# EasyEDA Pro project PCB_ESP32-music-int-document.epro

# Board PCB_PCB_ESP32-sd-int
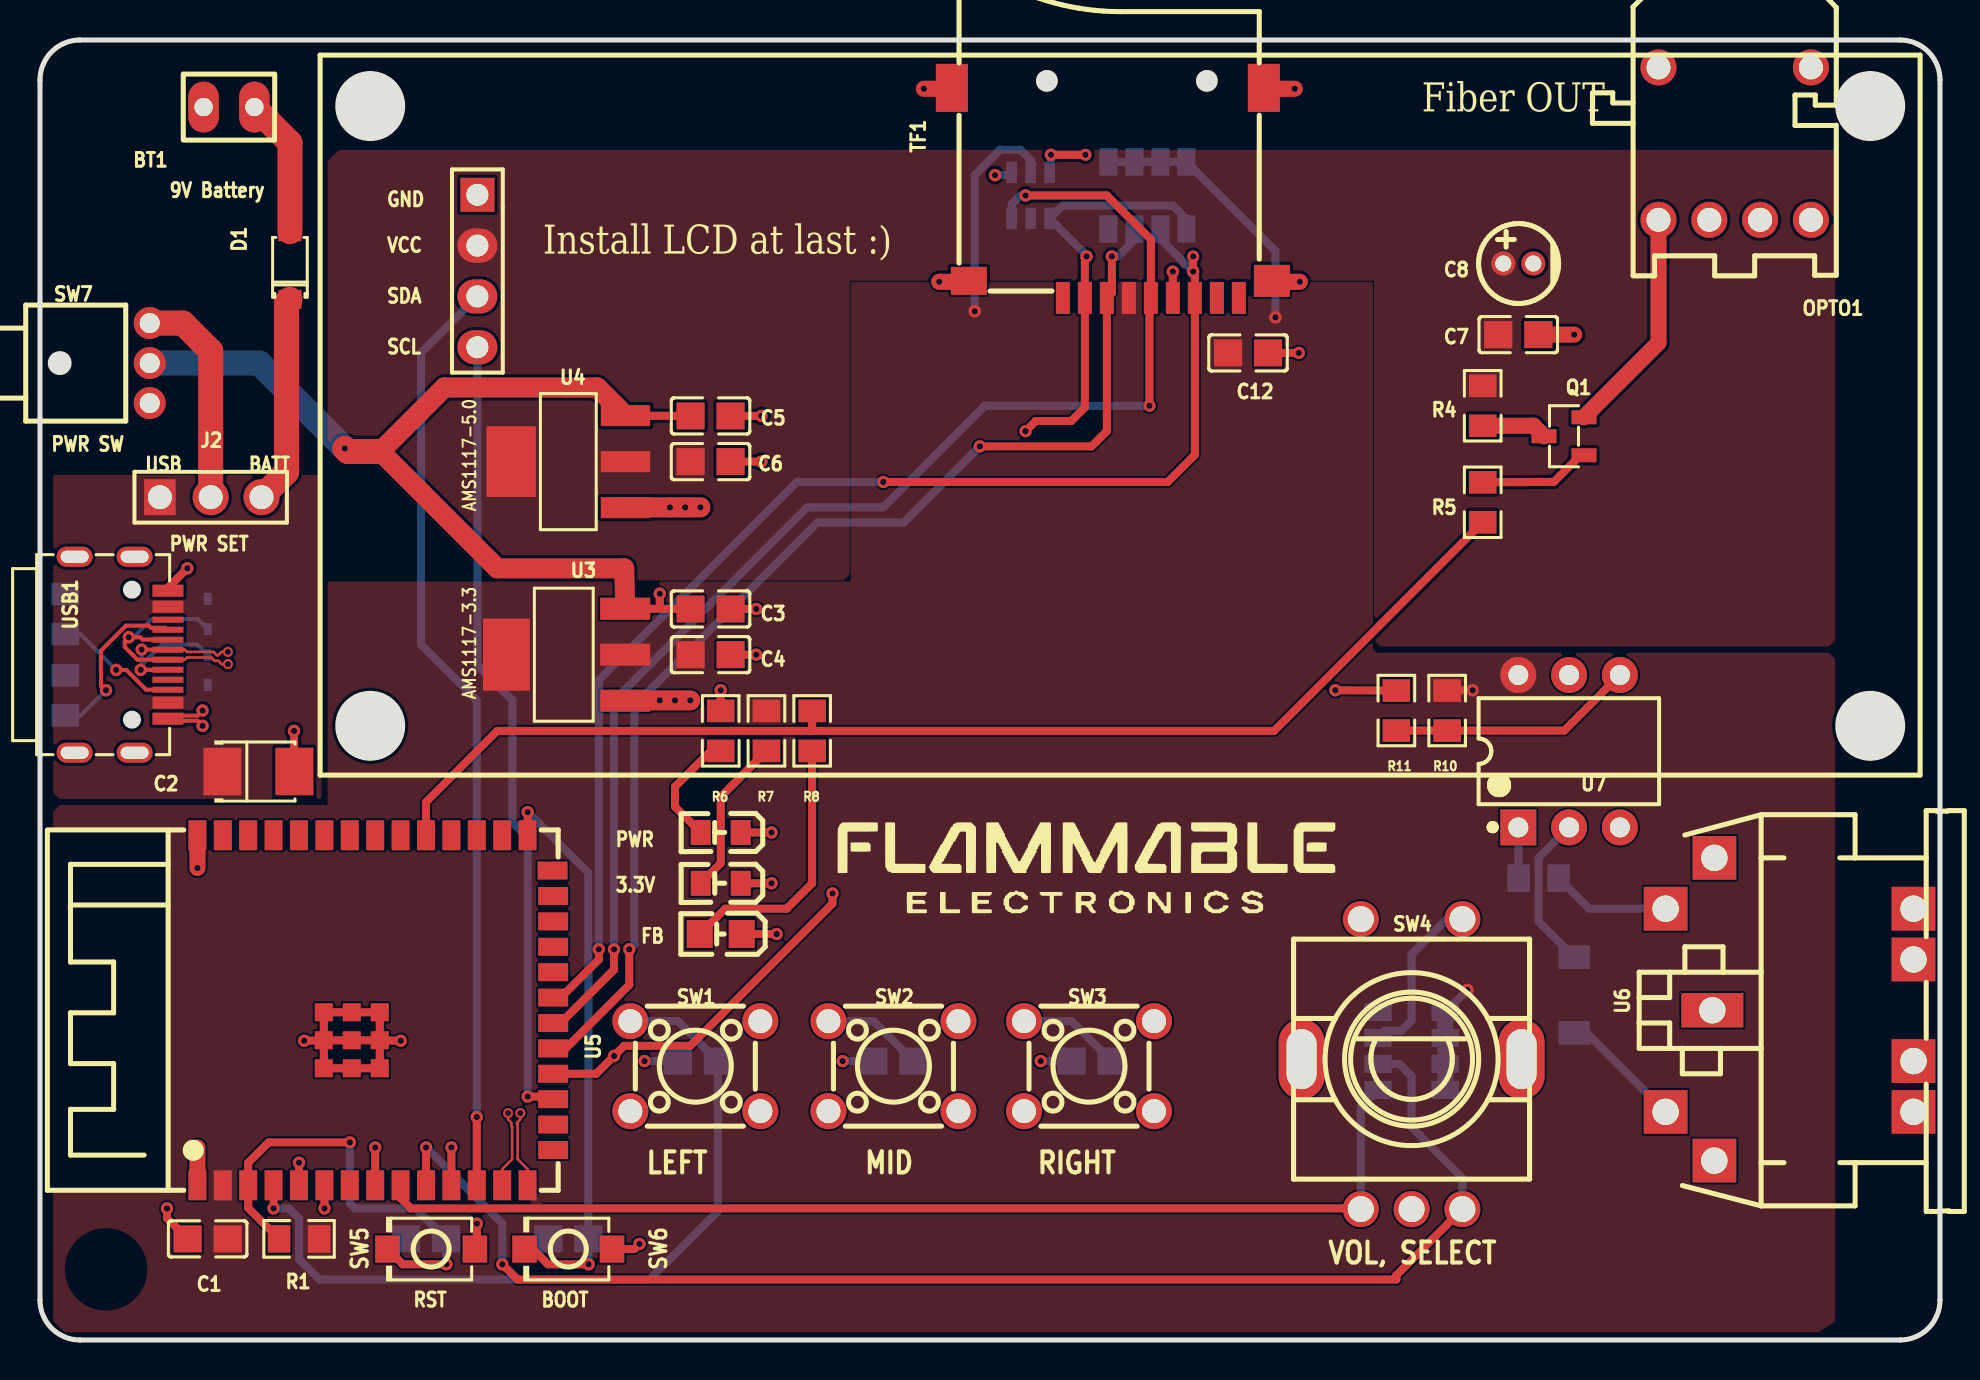
[diagram p0: board, top side]
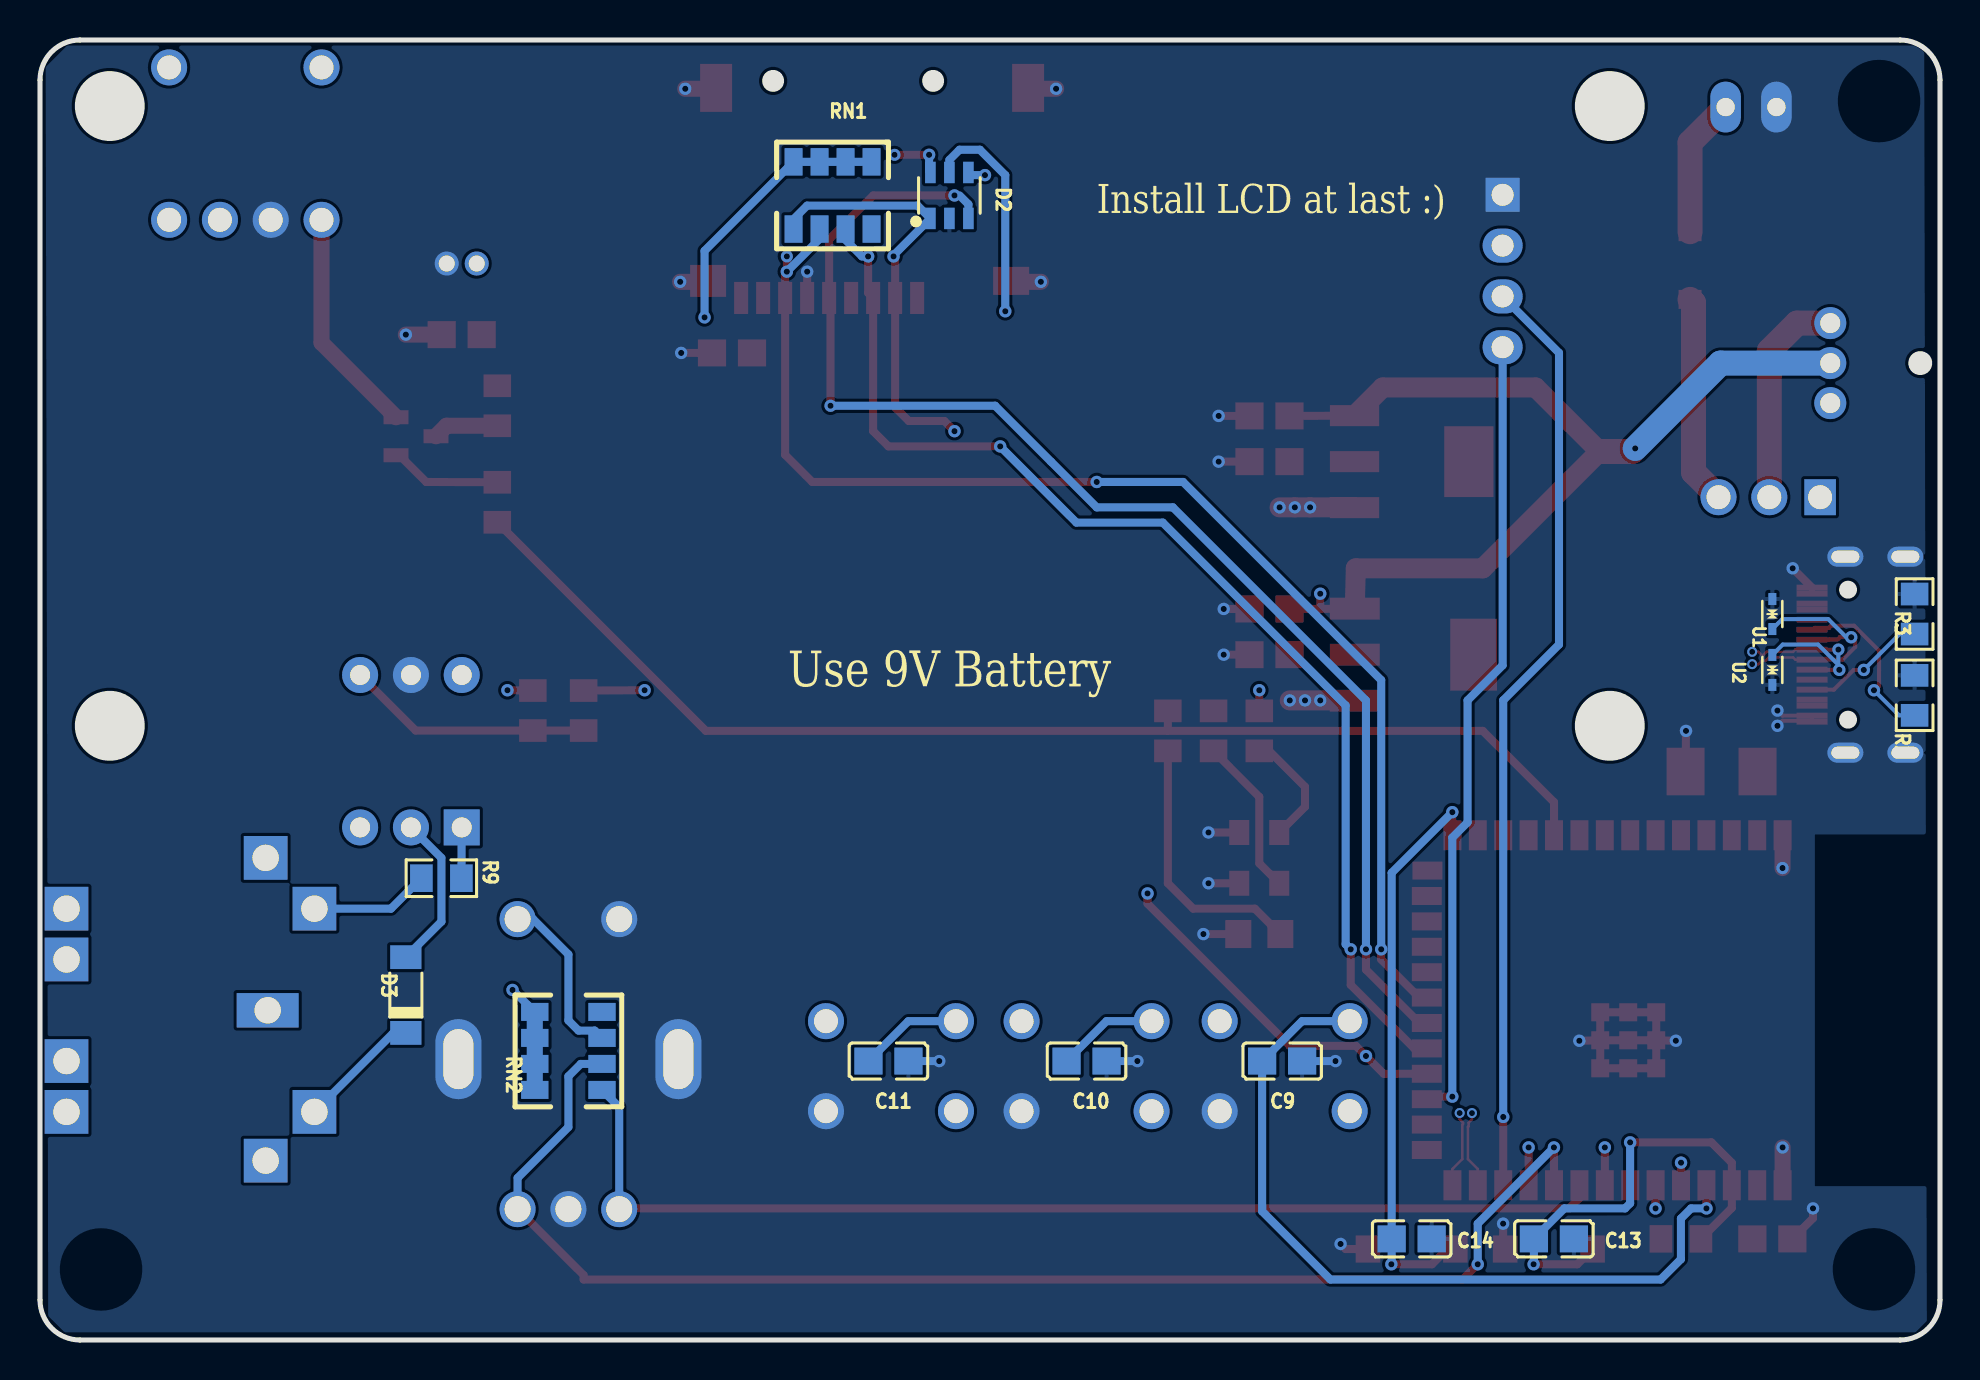
[diagram p1: board, bottom side, seen from below]

Outline 95 x 65 mm; copper layers: Top Layer, Inner1, Inner2, Bottom Layer. Coordinates in mm from the lower left corner of the outline.
Outline path: 0,63 arc(0.59,64.41) 2,65 93,65 arc(94.41,64.41) 95,63 95,2 arc(94.41,0.59) 93,0 2,0 arc(0.59,0.59) 0,2 0,63
Stack: Top Layer 0.035mm / Dielectric1 0.48mm PP er 4.5 / Inner1 0.035mm / Dielectric2 0.48mm FR4 er 4.5 / Inner2 0.035mm / Dielectric3 0.48mm PP er 4.5 / Bottom Layer 0.035mm

## Design rules (mm)
net USB_P: DP1
net USB_N: DP1
template: User Custom Config
spacing Default (default): track to track 0.1, other pairs 0 to 0.1
track width Default (default): min 0.254, default 0.254, max 25.4
differential pair differentialPair (default): width min 0.127, default 0.127, max 0.127; gap min 0.152, default 0.152
via Default (default): diameter min 0.5, default 0.6, max 100.025; hole min 0.3, default 0.305, max 59.995
pour e112 uses gge9877
pour e150 uses gge9877(1)
pour e344 uses gge17428
pour e346 uses gge21029
pour e340 uses copperRegion1

## Placement (name value [footprint] x y rotation side)
BT1  9V battery  [BAT-TH_2P-9VBATTERY]  9.45 61.65 180 top
C1  100nF  [C0805]  8.38 5.06 0 top
C2  10uF  [CAP-SMD_L3.2-W2.8-FD]  10.92 28.42 0 top
C3  10uF  [C0805]  33.53 36.55 180 top
C4  10uF  [C0805]  33.53 34.27 180 top
C5  10uF  [C0805]  33.53 46.2 180 top
C6  10uF  [C0805]  33.53 43.92 180 top
C7  100nF  [C0805]  73.91 50.27 0 top
C8  10uF  [CAP-TH_BD4.0-P1.50-D0.8-FD]  73.91 53.82 0 top
C9  100nF  [C0805]  32.89 13.95 0 bottom
C10  100nF  [C0805]  42.67 13.95 0 bottom
C11  100nF  [C0805]  52.58 13.95 0 bottom
C12  100nF  [C0805]  60.4 49.35 0 top
C13  100nF  [C0805]  19.3 5.06 0 bottom
C14  100nF  [C0805]  26.42 5.06 0 bottom
D1  DSS34  [SOD-123_L2.8-W1.8-LS3.7-RD]  12.5 53.72 90 top
D2  BV-SRV05-4  [SOT-23-6_L2.9-W1.6-P0.95-LS2.8-BL]  49.53 57.23 180 bottom
D3  1N4148-1206D  [LL-34_L3.5-W1.5-R-RD]  76.71 17.25 90 bottom
J2  Power settings  [HDR-TH_3P-P2.54-V-M-1]  8.53 42.14 0 top
LCD1  -  [I2CLCD16X2]  16.51 30.71 0 top
LED1  0805 SF-RED  [LED0805-RD_RED]  34.04 22.84 180 top
LED2  SF-RED  [LED0805-RD_RED]  34.04 25.38 180 top
LED3  YLED0805G  [LED0805-FD-GREEN]  34.03 20.3 0 top
OPTO1  HFBR-1521Z  [CONN-TH_HFBR-1521Z]  84.73 59.82 180 top
Q1  SS8050S  [SOT-23-3_L2.9-W1.3-P0.95-LS2.4-BR]  76.2 45.19 0 top
R1  10kΩ  [R0805]  12.95 5.06 0 top
R2  5.1kΩ  [R0805]  1.27 32.23 270 bottom
R3  5.1kΩ  [R0805]  1.27 36.3 270 bottom
R4  33Ω  [R0805]  72.14 46.71 90 top
R5  470Ω  [R0805]  72.14 41.89 90 top
R6  10kΩ  [R0805]  34.04 30.46 90 top
R7  1.3kΩ  [R0805]  36.32 30.46 90 top
R8  2.2kΩ  [R0805]  38.61 30.46 270 top
R9  220Ω  [R0805]  74.93 23.09 180 bottom
R10  180Ω  [R0805]  70.36 31.47 270 top
R11  47Ω  [R0805]  67.82 31.47 90 top
RN1  10kΩ  [RES-ARRAY-SMD_1206-8P-L5.1-W3.1-BL]  55.37 57.23 180 bottom
RN2  10kΩ  [RES-ARRAY-SMD_1206-8P-L5.1-W3.1-BL]  68.58 14.45 90 bottom
SW1  TC-6610-18.0  [SW-TH_4P-L6.0-W6.0-P4.50-LS6.5]  32.77 13.69 0 top
SW2  TC-6610-18.0  [SW-TH_4P-L6.0-W6.0-P4.50-LS6.5]  42.67 13.69 0 top
SW3  TC-6610-18.0  [SW-TH_4P-L6.0-W6.0-P4.50-LS6.5]  52.45 13.69 0 top
SW4  EC11E18244A5  [SW-TH_EC11E18244A5]  68.58 13.79 0 top
SW5  TS-1088-AR02016  [SW-SMD_L3.9-W3.0-P4.45]  19.56 4.55 180 top
SW6  TS-1088-AR02016  [SW-SMD_L3.9-W3.0-P4.45]  26.42 4.55 180 top
SW7  5.8 WSGT-3P CC  [SW-TH_3P-L5.8_WSGT-3P-CC]  5.49 48.85 270 top
TF1  SD  [TF-SMD_TF-15-15]  53.59 57.35 90 top
U1  LESD5D5.0CT1G_C5246195  [SOD-523_L1.2-W0.8-LS1.6-BI]  8.38 36.3 270 bottom
U2  LESD5D5.0CT1G_C5246195  [SOD-523_L1.2-W0.8-LS1.6-BI]  8.38 33.5 90 bottom
U3  AMS1117-3.3  [SOT-223-3_L6.5-W3.4-P2.30-LS7.0-BR]  26.29 34.27 0 top
U4  AMS1117-5.0  [SOT-223_L6.5-W3.5-P2.30-LS7.0-BR]  26.42 43.92 0 top
U5  ESP32-S3-WROOM-1(N8R8)  [WIRELM-SMD_ESP32-S3-WROOM-1]  16.76 16.49 90 top
U6  MIDIJACK  [CP-2350]  87.48 16.54 90 top
U7  H11L1  [DIP-6_L8.5-W6.4-P2.54-LS7.6-BL]  76.45 29.44 0 top
USB1  MUP-U20409-2  [USB-C-SMD_MUP-U20409-2]  4.06 34.27 270 top

## Footprints (pads in the part's own frame, mm; a bottom-side part is the same pattern mirrored in y, then rotated)
BAT-TH_2P-9VBATTERY
  oval 1.524x2.54 hole 0.914: 1(-1.27,0) 2(1.27,0)
C0805
  rect 1.41x1.35 smd: 1(-1,0) 2(1,0)
CAP-SMD_L3.2-W2.8-FD
  rect 1.9x2.376 smd: 1(-1.798,0) 2(1.798,0)
CAP-TH_BD4.0-P1.50-D0.8-FD
  round 1.2 hole 0.8: 1(-0.75,0) 2(0.75,0)
CONN-TH_HFBR-1521Z
  round 1.8 hole 1.2: 1(3.81,3.81) 2(1.27,3.81) 3(-1.27,3.81) 4(-3.81,3.81) 5(-3.81,-3.81) 8(3.81,-3.81)
CP-2350
  rect 2.184x2.184 hole 1.321: 1(7.569,3.76) 3(-7.569,3.76) 4(5.029,6.197) 5(-5.131,6.197) PE(-2.591,-6.197) PE1(-5.131,-6.197) PE2(5.029,-6.197) PE@(2.489,-6.197)
  rect 1.72x3.096 hole 1.321: 2(-0.051,3.861)
DIP-6_L8.5-W6.4-P2.54-LS7.6-BL
  rect 1.8x1.8 hole 1: 1(-2.54,-3.81)
  round 1.8 hole 1: 2(0,-3.81) 3(2.54,-3.81) 4(2.54,3.81) 5(0,3.81) 6(-2.54,3.81)
HDR-TH_3P-P2.54-V-M-1
  rect 1.575x1.8 hole 1.2: 1(-2.54,0)
  round 1.8 hole 1.2: 2(0,0) 3(2.54,0)
I2CLCD16X2
  rect 1.7x1.7 hole 1.1: 1(5.359,26.549)
  oval 2x1.7 hole 1.1: 2(5.359,24.009) 3(5.359,21.469) 4(5.359,18.929)
LED0805-FD-GREEN
  rect 1.3x1.399 smd: 1(-1.05,0) 2(1.05,0)
LED0805-RD_RED
  rect 1x1.25 smd: 1(-1,0) 2(1,0)
LL-34_L3.5-W1.5-R-RD
  rect 1.185x1.566 smd: 1(1.893,0) 2(-1.893,0)
R0805
  rect 1.133x1.377 smd: 1(-1,0) 2(1,0)
RES-ARRAY-SMD_1206-8P-L5.1-W3.1-BL
  rect 0.9x1.37 smd: 1(-1.95,-1.68) 2(-0.65,-1.68) 3(0.65,-1.68) 4(1.95,-1.68) 5(1.95,1.68) 6(0.65,1.68) 7(-0.65,1.68) 8(-1.95,1.68)
SOD-123_L2.8-W1.8-LS3.7-RD
  rect 0.95x1.15 smd: 1(-1.692,0) 2(1.692,0)
SOD-523_L1.2-W0.8-LS1.6-BI
  rect 0.6x0.4 smd: 1(-0.75,0) 2(0.75,0)
SOT-23-3_L2.9-W1.3-P0.95-LS2.4-BR
  rect 1.25x0.7 smd: 1(1,-0.95) 2(1,0.95) 3(-1,0)
SOT-23-6_L2.9-W1.6-P0.95-LS2.8-BL
  rect 0.532x1.072 smd: 1(-0.95,-1.149) 2(0,-1.149) 3(0.95,-1.149) 4(0.95,1.149) 5(0,1.149) 6(-0.95,1.149)
SOT-223-3_L6.5-W3.4-P2.30-LS7.0-BR
  rect 2.5x1.1 smd: 1(2.97,-2.3) 2(2.97,0) 3(2.97,2.3)
  rect 2.34x3.6 smd: 4(-2.97,0)
SOT-223_L6.5-W3.5-P2.30-LS7.0-BR
  rect 2.465x1.05 smd: 1(2.857,-2.3) 2(2.857,0) 3(2.857,2.3)
  rect 2.465x3.54 smd: 4(-2.857,0)
SW-SMD_L3.9-W3.0-P4.45
  rect 1.23x1.36 smd: 1(-2.185,0) 2(2.185,0)
SW-TH_3P-L5.8_WSGT-3P-CC
  round 1.6 hole 1: 1(-2,0) 2(0,0) 3(2,0)
SW-TH_4P-L6.0-W6.0-P4.50-LS6.5
  round 1.8 hole 1.2: 1(-3.25,2.25) 2(3.25,2.25) 3(-3.25,-2.25) 4(3.25,-2.25)
SW-TH_EC11E18244A5
  oval 2.3x4 hole 1.5x3: 6(5.5,0.25) 7(-5.5,0.25)
  round 1.8 hole 1.3: A(-2.54,-7.25) B(2.54,-7.25) C(0,-7.25) D(-2.54,7.25) E(2.54,7.25)
TF-SMD_TF-15-15
  rect 1.6x0.701 smd: 1(-5.252,2.45) 2(-5.252,1.35) 3(-5.252,0.25) 4(-5.252,-0.85) 5(-5.252,-1.95) 6(-5.252,-3.05) 7(-5.252,-4.15) 8(-5.252,-5.25) 9(-5.252,-6.35)
  rect 1.6x1.8 smd: 10(-4.399,-8)
  rect 2.4x1.6 smd: 11(5.252,-7.6) 12(5.252,8)
  rect 1.399x1.801 smd: 13(-4.398,7.151)
USB-C-SMD_MUP-U20409-2
  oval 1x1.8 hole 0.6x1.4: 17(4.9,0.667) 18(4.9,-2.333) 19(-4.9,-2.333) 20(-4.9,0.667)
  rect 0.3x1.55 smd: A1(-3.35,2.333) A4(-2.55,2.333) A5(-1.25,2.333) A6(-0.25,2.333) A7(0.25,2.333) A8(1.25,2.333) A9(2.55,2.333) A12(3.35,2.333) B1(3.05,2.333) B4(2.25,2.333) B5(1.75,2.333) B6(0.75,2.333) B7(-0.75,2.333) B8(-1.75,2.333) B9(-2.25,2.333) B12(-3.05,2.333)
WIRELM-SMD_ESP32-S3-WROOM-1
  rect 1.5x0.9 smd: 1(-8.75,8.895) 2(-8.75,7.625) 3(-8.75,6.355) 4(-8.75,5.085) 5(-8.75,3.815) 6(-8.75,2.545) 7(-8.75,1.275) 8(-8.75,0.005) 9(-8.75,-1.265) 10(-8.75,-2.535) 11(-8.75,-3.805) 12(-8.75,-5.075) 13(-8.75,-6.345) 14(-8.75,-7.615) 27(8.75,-7.615) 28(8.75,-6.345) 29(8.75,-5.075) 30(8.75,-3.805) 31(8.75,-2.535) 32(8.75,-1.265) 33(8.75,0.005) 34(8.75,1.275) 35(8.75,2.545) 36(8.75,3.815) 37(8.75,5.085) 38(8.75,6.355) 39(8.75,7.625) 40(8.75,8.895)
  rect 0.9x1.5 smd: 15(-6.985,-8.895) 16(-5.715,-8.895) 17(-4.445,-8.895) 18(-3.175,-8.895) 19(-1.905,-8.895) 20(-0.635,-8.895) 21(0.635,-8.895) 22(1.905,-8.895) 23(3.175,-8.895) 24(4.445,-8.895) 25(5.715,-8.895) 26(6.985,-8.865)
  rect 0.9x0.9 smd: 41(-2.9,2.575) 41(-2.9,1.175) 41(-2.9,-0.225) 41(-1.5,2.575) 41(-1.5,1.175) 41(-1.5,-0.226) 41(-0.1,2.575) 41(-0.1,1.175) 41(-0.1,-0.225)

## Nets
+3.3V: C1.2 C4.2 C12.1 D2.5 R1.2 R7.2 R10.1 RN1.5 RN1.6 RN1.7 RN1.8 RN2.5 RN2.6 RN2.7 RN2.8 TF1.4 U3.2 U3.4 U5.2 U7.6
+5V: C6.2 C7.1 C8.1 LCD1.2 R4.2 U4.2 U4.4
GND: BT1.2 C1.1 C2.2 C3.1 C4.1 C5.1 C6.1 C7.2 C8.2 C9.1 C10.1 C11.1 C12.2 C13.1 C14.1 D2.2 LCD1.1 LED1.1 LED2.1 LED3.2 OPTO1.2 R2.1 R3.1 SW1.4 SW2.4 SW3.4 SW4.6 SW4.7 SW4.C SW4.D SW5.1 SW6.1 TF1.6 TF1.10 TF1.11 TF1.12 TF1.13 U1.1 U2.1 U3.1 U4.1 U5.1 U5.40 U5.41 U7.5 USB1.17 USB1.18 USB1.19 USB1.20 USB1.A1 USB1.A12 USB1.B1 USB1.B12
VBUS: C2.1 J2.1 USB1.A4 USB1.A9 USB1.B4 USB1.B9
VIN: BT1.1 D1.2
BTN1: C9.2 SW1.1 U5.4
BTN2: C10.2 SW2.1 U5.5
BTN3: C11.2 SW3.1 U5.6
CHIP_EN: C13.2 R1.1 SW5.2 U5.3
CLK: D2.3 TF1.5 U5.20
CS: D2.1 RN1.1 TF1.2 U5.18
ENC_A: RN2.1 SW4.A U5.9
ENC_B: RN2.2 SW4.B U5.10
ENC_SW: RN2.3 SW4.E U5.11
FB: R5.1 R8.1 U5.31
IO0: C14.2 SW6.2 U5.27
MIDI_RX: R11.2 U5.8
MISO: D2.6 RN1.2 TF1.7 U5.21
MOSI: D2.4 RN1.3 TF1.3 U5.19
SCLK: LCD1.4 U5.17
SDA: LCD1.3 U5.12
USB_N: U1.2 U5.13 USB1.A7 USB1.B7
USB_P: U2.2 U5.14 USB1.A6 USB1.B6
VSET: C3.2 C5.2 R6.2 SW7.2 U3.3 U4.3
$1N2: R3.2 USB1.B5
$1N4: R2.2 USB1.A5
$1N45: Q1.1 R5.2
$1N72: D1.1 J2.3
$1N93: LED2.2 R6.1
$1N100: R9.1 U6.4
$1N101: R9.2 U7.1
$1N102: D3.1 U7.2
$1N103: D3.2 U6.5
$1N106: R10.2 R11.1 U7.4
$1N109: Q1.3 R4.1
$1N110: OPTO1.1 Q1.2
$1N111: LED3.1 R8.2
$1N114: LED1.2 R7.1
$1N6735: J2.2 SW7.1

Pads without a net: OPTO1 3 4 5 8; RN1 4; RN2 4; SW1 2 3; SW2 2 3; SW3 2 3; SW7 3; TF1 1 8 9; U5 7 15 16 22 23 24 25 26 28 29 30 32 33 34 35 36 37 38 39; U6 1 2 3 PE PE1 PE2 PE@; U7 3; USB1 A8 B8

## Via types
v1: diameter 0.62, hole 0.31, Top Layer to Bottom Layer, 72 vias
v2: diameter 0.61, hole 0.305, Top Layer to Bottom Layer, 3 vias
v3: diameter 0.6, hole 0.305, Top Layer to Bottom Layer, 2 vias
v4: diameter 0.5, hole 0.3, Top Layer to Bottom Layer, 4 vias

## Routing (per net, layer and track width the routed paths; a pad name or vN(x,y) marks a point on that pad's centre or on a via; arc(x,y) is an arc through that point)
+3.3V: length 31.2
  Top Layer w0.402: R10.1 v1(71.63,32.49)
  Bottom Layer w0.402: v1(61.77,51.13) 61.77,54.46 RN1.8 RN1.7 RN1.6 RN1.5 ; RN2.5 v1(71.37,17.5) ; D2.5 49.53,59.01 49.02,59.51 48.01,59.51 46.74,58.24 v1(46.74,51.44)
  Bottom Layer w0.803: RN2.5 RN2.6 RN2.7 RN2.8
GND: length 64.8
  Top Layer w0.201: v1(8.13,30.71) 7.87,30.96 6.44,30.96 USB1.A12 USB1.B1 7.87,31.22 v1(8.13,31.47) ; USB1.A1 USB1.B12
  Top Layer w0.402: C3.1 v1(35.81,36.55) ; 16.99,14.99 U5.41 ; 16.99,14.99 U5.41 U5.41 U5.41 ; 16.99,14.99 U5.41 U5.41 U5.41 ; 35.09,20.3 v1(36.83,20.3) ; v1(21.84,5.82) 21.84,4.65 SW5.1 ; C4.1 v1(35.81,34.27) ; v1(29.97,4.8) 29.72,4.55 SW6.1 ; v1(6.35,6.58) 6.35,6.09 C1.1 ; LED1.1 v1(36.58,22.84) ; C2.2 v1(12.7,30.46) ; C6.1 v1(36.07,43.92) ; 16.99,14.98 v1(18.03,14.96) ; LED2.1 v1(36.58,25.38) ; USB1.A1 7.36,38.58 ; 56.64,52.1 v1(56.64,53.42) ; v1(13.21,14.96) 14.19,14.98 ; C12.2 v1(62.94,49.35) ; C5.1 v1(36.07,46.2)
  Top Layer w0.803: v1(62.99,52.91) 61.64,52.91 TF1.10 ; v1(44.96,52.91) 46.4,52.91 TF1.13 ; v1(62.74,62.56) 61.24,62.56 TF1.11 ; U5.1 v1(7.87,9.63) ; v1(44.2,62.56) 45.55,62.56 TF1.12 ; C7.2 v1(76.71,50.27) ; U5.40 v1(7.87,23.6)
  Top Layer w1: v1(32.51,31.98) 29.29,31.98 29.26,31.95 ; v1(33.02,41.63) v1(32.26,41.63) v1(31.5,41.63) 29.29,41.63 29.27,41.62
  Bottom Layer w0.402: v1(50.04,13.95) C11.1 ; v1(40.13,13.95) C10.1 ; C9.1 v1(30.23,13.95)
  vias: v1(7.37,38.58) v1(30.99,31.98) v1(31.75,31.98)
VIN: length 7
  Top Layer w1.25: BT1.1 12.5,59.87 12.5,55.42
BTN1: length 40.2
  Top Layer w0.402: U5.4 v1(11.68,6.58)
  Bottom Layer w0.402: SW1.1 31.9,15.94 C9.2 33.89,6.44 30.48,3.02 13.97,3.02 12.95,4.04 12.95,6.07 12.45,6.58 v1(11.68,6.58)
BTN2: length 38.1
  Top Layer w0.402: U5.5 v1(12.95,8.87)
  Inner1 w0.402: SW2.1 37.59,14.11 37.59,9.88 36.58,8.87 v1(12.95,8.87)
  Bottom Layer w0.402: SW2.1 41.68,15.94 C10.2
BTN3: length 47.6
  Top Layer w0.402: v1(14.22,6.58) U5.6
  Inner1 w0.402: SW3.1 47.5,14.24 47.5,10.14 43.94,6.58 v1(14.22,6.58)
  Bottom Layer w0.402: C11.2 51.58,15.94 SW3.1
CHIP_EN: length 23.1
  Top Layer w0.402: v1(20.32,3.79) 18.13,3.79 SW5.2 ; v1(15.49,9.88) 11.43,9.88 10.41,8.86 U5.3 10.41,6.6 R1.1
  Bottom Layer w0.402: v1(20.32,3.79) 20.3,3.8 C13.2 18.78,6.58 15.75,6.58 15.49,6.83 v1(15.49,9.88)
CLK: length 67.3
  Top Layer w0.402: TF1.5 55.54,55.02 53.34,57.23 v1(49.28,57.23) ; 25.66,15.85 26.03,15.85 28.7,18.52 v1(28.7,19.53)
  Top Layer w0.406: TF1.5 55.47,52.03 v2(55.47,46.71)
  Bottom Layer w0.402: 44.45,43.92 42.16,41.63 38.35,41.63 28.7,31.98 v1(28.7,19.53) ; D2.3 48.58,56.79 49.02,57.23
  Bottom Layer w0.406: 44.45,43.92 47.24,46.71 v2(55.47,46.71)
CS: length 66.7
  Top Layer w0.402: 25.66,13.31 27.81,13.31 v1(28.7,14.2) 29.21,14.71 32.51,14.71 39.62,21.82 v1(39.62,22.33) ; v1(49.28,45.44) 49.78,45.95 51.56,45.95 52.24,46.63 TF1.2 52.24,54.1 v1(52.32,54.18)
  Inner1 w0.402: v1(49.28,45.44) 49.28,31.98 v1(39.62,22.33)
  Bottom Layer w0.402: v1(52.32,54.18) 52.32,54.23 D2.1 51.12,56.72 56.64,56.72 57.32,56.04 RN1.1
ENC_A: length 55.2
  Top Layer w0.402: SW4.A 66,6.58 18.54,6.58 18.03,7.09 U5.9
  Bottom Layer w0.402: RN2.1 66.04,11.64 SW4.A
ENC_B: length 68.9
  Top Layer w0.402: SW4.B 67.82,3.24 67.82,3.02 23.88,3.02 v1(23.11,3.79) ; 19.3,7.74 19.3,8.61 19.3,8.61 v1(19.3,9.63)
  Bottom Layer w0.402: RN2.2 67.96,13.8 68.58,13.18 68.58,10.64 71.12,8.1 SW4.B ; v1(23.11,3.79) 23.11,5.82 v1(19.3,9.63)
ENC_SW: length 69.5
  Top Layer w0.402: U5.11 v1(20.57,9.63)
  Inner1 w0.402: v1(20.57,9.63) 26.92,9.63 27.94,10.64 27.94,16.99 29.21,18.26 68.34,18.26 SW4.E
  Bottom Layer w0.402: SW4.E 70.34,21.04 68.58,19.28 68.58,15.98 68.07,15.47 67.27,15.47 RN2.3
FB: length 61.3
  Top Layer w0.402: R8.1 38.61,30.46 ; 19.3,25.24 19.3,26.89 22.86,30.46 61.71,30.46 R5.1
IO0: length 28.5
  Top Layer w0.402: SW6.2 24.64,4.55 25.4,3.79 v1(27.43,3.79) ; 24.38,25.24 v1(24.38,26.39)
  Bottom Layer w0.402: v1(27.43,3.79) 27.42,3.8 C14.2 27.42,23.36 v1(24.38,26.39)
MIDI_RX: length 71
  Top Layer w0.402: v1(64.77,32.49) R11.2 ; U5.8 v1(16.76,9.63)
  Inner1 w0.402: v1(64.77,32.49) 62.99,30.71 62.99,21.82 60.2,19.03 29.21,19.03 27.18,16.99 27.18,11.15 26.67,10.64 17.78,10.64 v1(16.76,9.63)
MISO: length 74.4
  Top Layer w0.402: v3(52.27,59.26) v1(50.55,59.26) ; v1(42.16,42.9) 56.39,42.9 57.74,44.26 TF1.7 57.74,53.33 v1(57.66,53.42) v3(57.66,54.18) ; v1(27.94,19.53) 27.94,19.03 26.03,17.12 25.66,17.12
  Inner1 w0.402: v3(57.66,54.18) 57.35,54.18 v3(52.27,59.26)
  Bottom Layer w0.402: D2.6 50.55,58.44 v1(50.55,59.26) ; RN1.2 56.02,55.05 v1(57.66,53.42) ; v1(42.16,42.9) 37.85,42.9 27.94,33 v1(27.94,19.53)
MOSI: length 68.1
  Top Layer w0.402: v1(53.59,54.18) 53.59,52.35 TF1.3 53.34,45.45 52.58,44.68 v1(46.99,44.68) ; 25.66,14.58 26.29,14.58 29.46,17.76 v1(29.46,19.53)
  Inner1 w0.402: 53.34,54.43 52.58,55.2 49.78,55.2 47.75,57.23 v1(47.75,58.24)
  Bottom Layer w0.402: v1(46.99,44.68) 43.18,40.87 38.86,40.87 29.72,31.73 29.72,19.79 v1(29.46,19.53) ; v1(47.75,58.24) 48.45,58.24 D2.4 ; v1(53.59,54.18) 53.9,54.18 54.87,55.16 54.87,55.4 RN1.3
SCLK: length 39.8
  Top Layer w0.402: v1(24.38,12.17) 25.53,12.17 25.66,12.04
  Bottom Layer w0.402: LCD1.4 21.87,33.73 23.62,31.98 23.62,25.88 24.38,25.12 v1(24.38,12.17)
SDA: length 46.8
  Top Layer w0.402: U5.12 v1(21.84,11.15)
  Bottom Layer w0.402: LCD1.3 19.05,49.36 19.05,34.77 21.84,31.98 v1(21.84,11.15)
USB_N: length 45.5
  Top Layer w0.127: USB1.A7 7.23,34.02 7.35,34.13 8.56,34.13 8.73,33.96 8.91,33.96 9.08,33.79 v4(9.39,33.79) ; v4(23.4,11.35) 23.4,11.03 23.57,10.86 23.57,10.68 23.6,10.65 23.6,9.05 23.11,8.55 U5.13
  Top Layer w0.201: USB1.A7 4.87,34.02 4.24,34.65 4.24,34.94 v1(4.44,35.14) 5.01,35.14 5.12,35.03 5.54,35.03 5.55,35.02 USB1.B7
  Inner1 w0.127: v4(9.39,33.79) 9.71,33.79 9.88,33.96 9.94,33.96 9.98,33.92 9.98,25.48 23.57,11.89 23.57,11.83 23.4,11.66 v4(23.4,11.35)
  Bottom Layer w0.201: U1.2 7.89,36.04 5.59,36.04 4.68,35.14 v1(4.44,35.14)
USB_P: length 44.1
  Top Layer w0.127: 24.38,7.74 24.38,8.55 23.88,9.05 23.88,10.77 23.85,10.8 23.85,10.87 24.02,11.03 v4(24.02,11.35) ; USB1.A6 7.23,34.52 7.35,34.41 8.68,34.41 8.85,34.24 8.91,34.24 9.08,34.41 v4(9.39,34.41)
  Top Layer w0.201: USB1.A6 5.09,34.52 v2(5.08,34.52) ; USB1.B6 6.39,33.51 v1(5.04,33.51)
  Inner1 w0.127: v4(24.02,11.35) 24.02,11.66 23.85,11.83 23.85,12.01 10.26,25.6 10.26,34.03 10.06,34.24 9.87,34.24 9.7,34.41 v4(9.39,34.41)
  Bottom Layer w0.201: 5.08,33.76 5.08,33.55 v1(5.04,33.51) ; 5.08,33.76 v2(5.08,34.52) ; 5.08,33.76 6.1,34.77 7.86,34.77 U2.2
VSET: length 58.6
  Top Layer w0.402: R6.2 v1(34.04,32.49) ; 31.09,36.56 C3.2 ; 31.09,36.56 29.26,36.56 ; 31.09,36.56 30.99,36.66 v1(30.99,37.31) ; 29.27,46.22 C5.2
  Top Layer w1: 29.26,36.56 29.21,38.58 22.86,38.58 17.02,44.43 20.22,47.63 27.86,47.63 U4.3
  Top Layer w1.25: v2(15.24,44.58) 15.39,44.43 17.02,44.43
  Inner1 w0.402: v1(30.99,37.31) 34.04,34.27 v1(34.04,32.49)
  Bottom Layer w1.25: SW7.2 10.97,48.85 v2(15.24,44.58)
$1N2: length 6.3
  Top Layer w0.201: USB1.B5 5.31,32.52 4.32,33.5 v1(3.81,33.5)
  Bottom Layer w0.201: R3.2 2.02,35.3 v1(3.81,33.5)
$1N4: length 8.6
  Top Layer w0.201: v1(3.3,32.49) 3.25,32.49 3.05,32.69 3.05,33.49 3.05,33.49 3.05,33.92 3.05,33.92 3.05,34.47 4.3,35.72 5.43,35.72 5.54,35.61 6.25,35.61 6.34,35.52 USB1.A5
  Bottom Layer w0.201: R2.2 2.05,31.23 v1(3.3,32.49)
$1N45: length 5.6
  Top Layer w0.402: Q1.1 77.03,44.24 75.69,42.9 72.14,42.89
$1N72: length 10.5
  Top Layer w1.25: D1.1 12.32,51.86 12.32,43.39 J2.3
$1N93: length 5.8
  Top Layer w0.402: LED2.2 31.75,26.66 31.75,27.66 33.54,29.46 R6.1
$1N100: length 6
  Bottom Layer w0.402: R9.1 77.45,21.57 U6.4
$1N101: length 2.5
  Bottom Layer w0.402: 73.93,23.09 U7.1
$1N102: length 7.9
  Bottom Layer w0.402: D3.1 74.93,20.92 74.93,24.11 U7.2
$1N103: length 6.2
  Bottom Layer w0.402: D3.2 77.33,15.36 U6.5
$1N106: length 12.3
  Top Layer w0.402: R11.1 R10.2 76.22,30.47 U7.4
$1N109: length 3.3
  Top Layer w0.803: Q1.3 74.68,45.71 R4.1
$1N110: length 11.4
  Top Layer w0.803: Q1.2 80.92,49.86 OPTO1.1
$1N111: length 13.3
  Top Layer w0.402: 32.99,20.3 34.26,21.57 37.34,21.57 38.61,22.84 R8.2
$1N114: length 8
  Top Layer w0.402: R7.1 34.04,27.15 34.04,23.83 33.04,22.84
$1N6735: length 10.9
  Top Layer w1.25: SW7.1 7.14,50.85 8.53,49.46 J2.2

## Copper pours and planes (outline as drawn; the poured copper is in the pictures)
+3.3V on Top Layer: 14.48,37.82 14.48,26.65 1.02,26.65 0.76,26.39 0.76,0.99 1.27,0.48 88.9,0.48 89.66,0.99 89.66,34.01 89.41,34.27 66.8,34.27 66.55,34.52 66.55,52.81 40.64,52.81 40.64,37.82
+5V on Top Layer: 89.66,35.03 89.41,34.77 67.06,34.77 66.8,35.03 66.8,53.06 40.39,53.06 40.39,52.81 40.39,38.33 40.13,38.08 14.73,38.08 14.48,38.33 14.48,58.9 14.99,59.41 89.66,59.41
GND on Bottom Layer: 0.89,64.62 0.76,0.99 1.27,0.48 93.73,0.48 94.49,1.25 94.62,63.6 93.6,64.62
GND on Inner2: 0.87,64.65 0.74,1.02 1.25,0.51 93.7,0.51 94.46,1.27 94.59,63.63 93.58,64.65
VBUS on Top Layer: 0.76,43.16 0.76,27.41 1.02,27.15 13.97,27.15 13.97,43.16

## Text on the board
Bottom Silkscreen Layer: Install LCD at last :) | Use 9V Battery
Top Silkscreen Layer: AMS1117-5.0 | AMS1117-3.3 | PWR SW | 9V Battery | GND | VCC | SDA | SCL | RST | BOOT | PWR | 3.3V | FB | USB | PWR SET | BATT | SW5 | SW6 | LEFT | MID | RIGHT | VOL, SELECT | Install LCD at last :) | Fiber OUT
